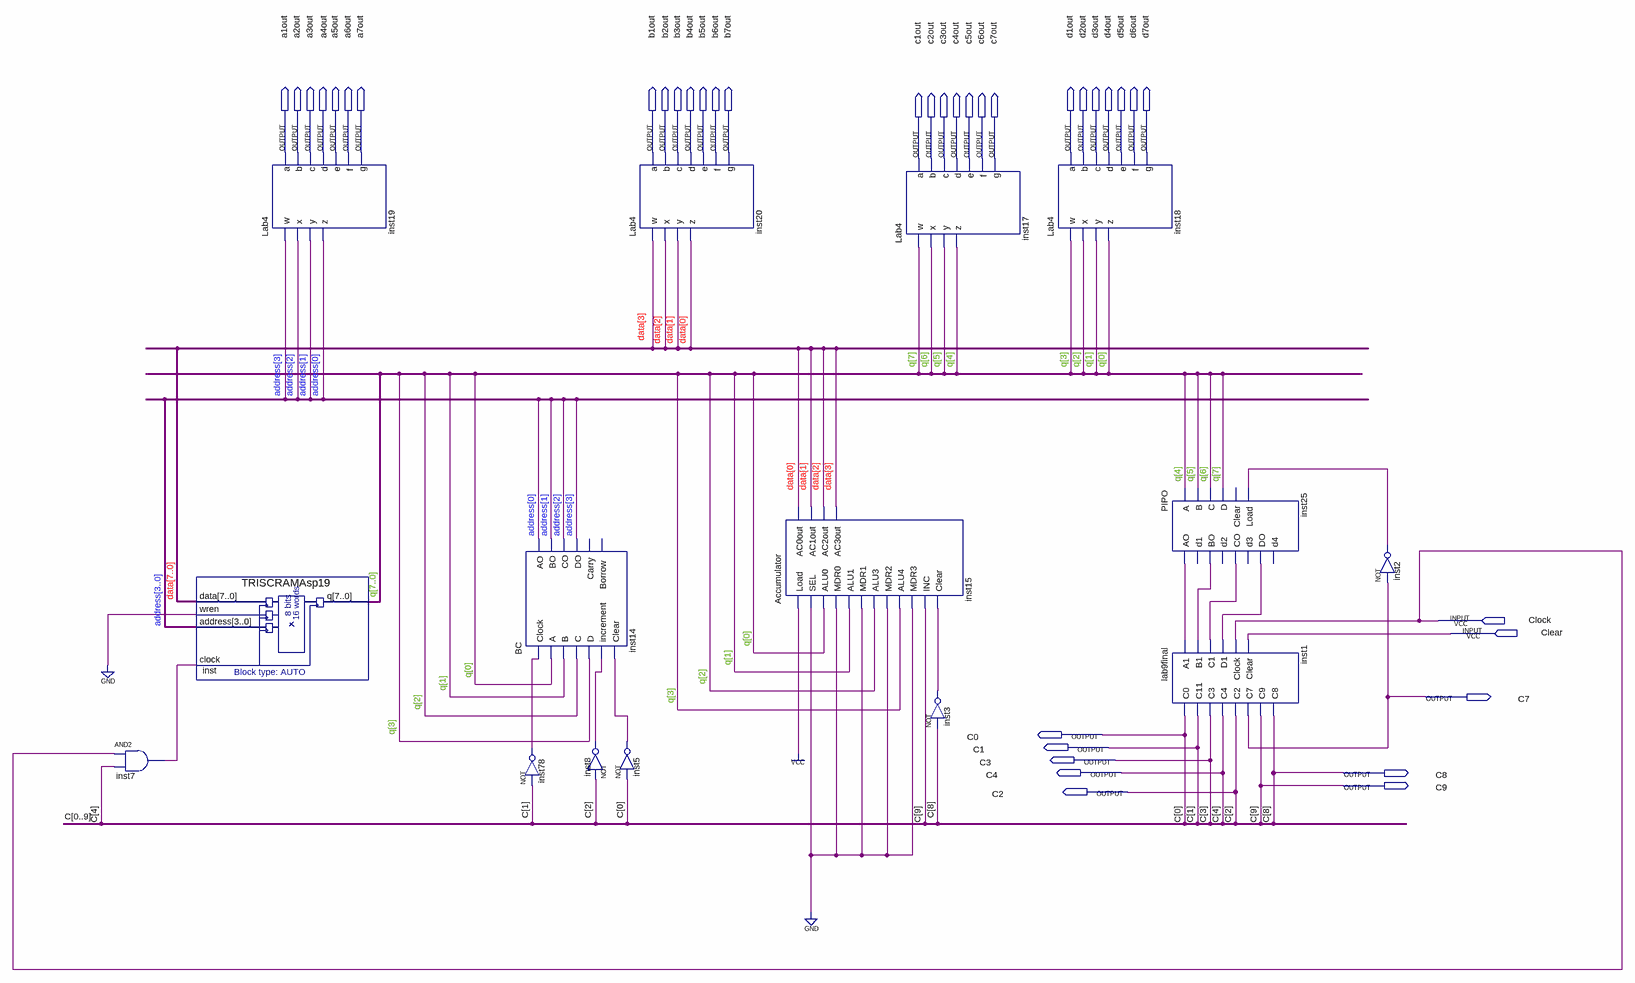
[diagram p0: schematic sheet]
// Quartus schematic PartA.bdf as structural Verilog: 15 symbols, 38 pins
module PartA (
  input  Clock,
  input  Clear,
  output a1out,
  output a2out,
  output a3out,
  output a4out,
  output a5out,
  output a6out,
  output a7out,
  output b1out,
  output b2out,
  output b3out,
  output b4out,
  output b5out,
  output b6out,
  output b7out,
  output d1out,
  output d2out,
  output d3out,
  output d4out,
  output d5out,
  output d6out,
  output d7out,
  output c1out,
  output c2out,
  output c3out,
  output c4out,
  output c5out,
  output c6out,
  output c7out,
  output C7,
  output C0,
  output C1,
  output C3,
  output C4,
  output C8,
  output C9,
  output C2
);

  wire inst2_out, inst3_out, inst5_out, inst7_out, inst8_out, inst25_ao, inst25_bo, inst25_co, inst25_do,
       inst78_out;
  wire [3:0] address;
  wire [7:0] data, q;

  and inst7 (inst7_out, Clock, C4);
  TRISCRAMAsp19 inst (.data(data), .wren(1'b0), .address(address), .clock(inst7_out), .q(q));
  Lab4 inst19 (
    .w(address[3]), .x(address[2]), .y(address[1]), .z(address[0]), .a(a1out), .b(a2out), .c(a3out),
    .d(a4out), .e(a5out), .f(a6out), .g(a7out));
  BC inst14 (
    .Clock(inst78_out), .A(q[0]), .B(q[1]), .C(q[2]), .D(q[3]), .increment(inst8_out), .Clear(inst5_out),
    .AO(address[0]), .BO(address[1]), .CO(address[2]), .DO(address[3]));  // open: Carry, Borrow
  not inst78 (inst78_out, C1);
  not inst8 (inst8_out, C2);
  Lab4 inst20 (
    .w(data[3]), .x(data[2]), .y(data[1]), .z(data[0]), .a(b1out), .b(b2out), .c(b3out), .d(b4out),
    .e(b5out), .f(b6out), .g(b7out));
  not inst5 (inst5_out, C0);
  Accumulator inst15 (
    .Load(1'b1), .SEL(1'b0), .ALU0(q[0]), .MDR0(1'b0), .ALU1(q[1]), .MDR1(1'b0), .ALU3(q[2]), .MDR2(1'b0),
    .ALU4(q[3]), .MDR3(1'b0), .INC(C9), .Clear(inst3_out), .AC0out(data[0]), .AC1out(data[1]),
    .AC2out(data[2]), .AC3out(data[3]));
  Lab4 inst17 (
    .w(q[7]), .x(q[6]), .y(q[5]), .z(q[4]), .a(c1out), .b(c2out), .c(c3out), .d(c4out), .e(c5out), .f(c6out),
    .g(c7out));
  not inst3 (inst3_out, C8);
  Lab4 inst18 (
    .w(q[3]), .x(q[2]), .y(q[1]), .z(q[0]), .a(d1out), .b(d2out), .c(d3out), .d(d4out), .e(d5out), .f(d6out),
    .g(d7out));
  PIPO inst25 (
    .A(q[4]), .B(q[5]), .C(q[6]), .D(q[7]), .Load(inst2_out), .AO(inst25_ao), .BO(inst25_bo), .CO(inst25_co),
    .DO(inst25_do));  // open: Clear, d1, d2, d3, d4
  lab9final inst1 (
    .A1(inst25_ao), .B1(inst25_bo), .C1(inst25_co), .D1(inst25_do), .Clock(Clock), .Clear(Clear), .C0(C0),
    .C11(C1), .C3(C3), .C4(C4), .C2(C2), .C7(C7), .C9(C9), .C8(C8));
  not inst2 (inst2_out, C7);
endmodule
